# EAGLE schematic ButtonBreakout (EAGLE 9.5.0)
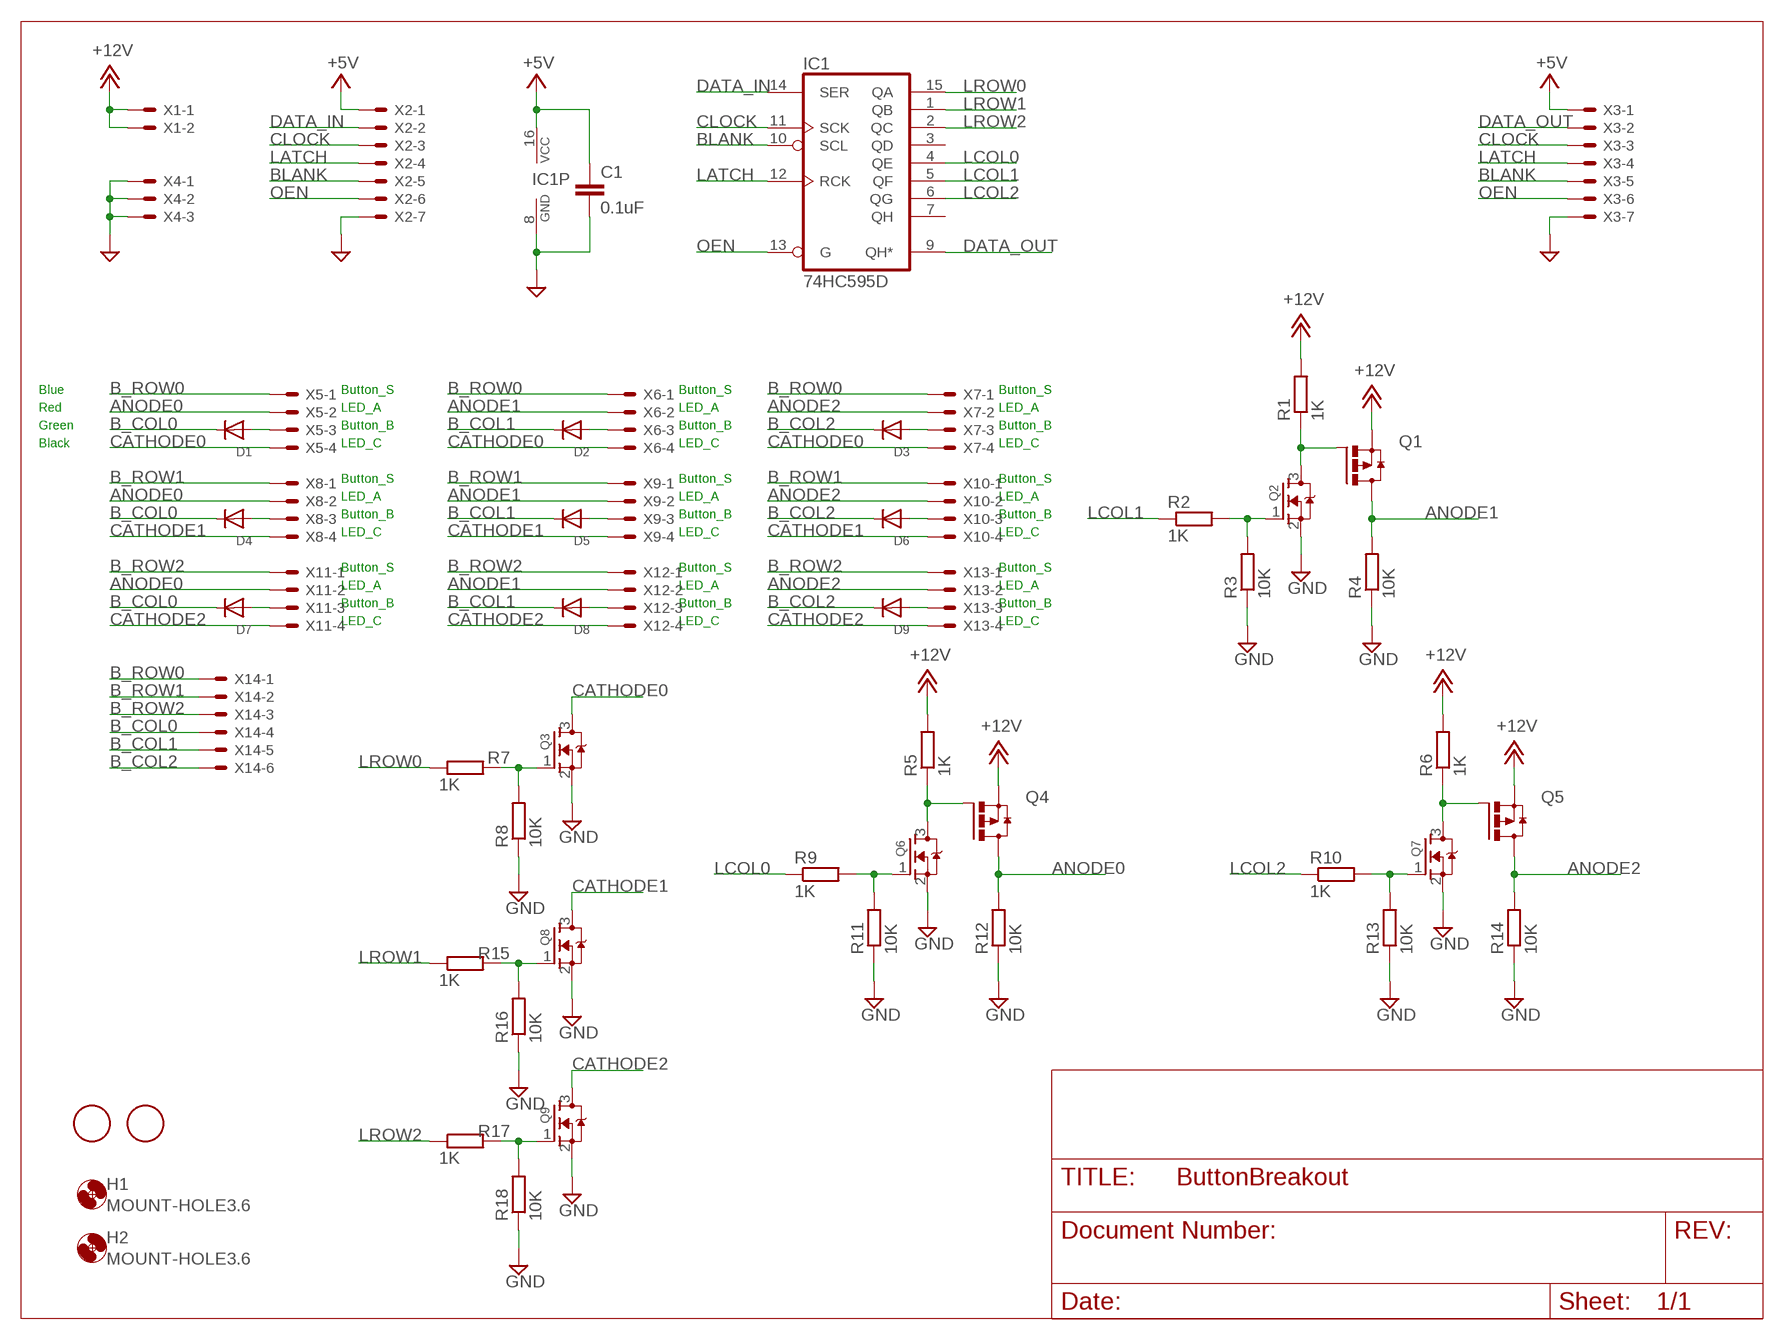
[diagram p0: schematic, sheet 1]

## Parts
C1  0.1uF  C-EUC0805  [C0805]
D1  DIODESOD-123  [SOD-123]
D2  DIODESOD-123  [SOD-123]
D3  DIODESOD-123  [SOD-123]
D4  DIODESOD-123  [SOD-123]
D5  DIODESOD-123  [SOD-123]
D6  DIODESOD-123  [SOD-123]
D7  DIODESOD-123  [SOD-123]
D8  DIODESOD-123  [SOD-123]
D9  DIODESOD-123  [SOD-123]
F1  FIDUCIAL  [FIDUCIAL_1MM]
F2  FIDUCIAL  [FIDUCIAL_1MM]
H1  MOUNT-HOLE3.6  [3,6]
H2  MOUNT-HOLE3.6  [3,6]
IC1  74HC595D  [SO16]
Q1  FDN360P  [SUPER-SOT3]
Q2  MOSFET-NREFLOW  [SOT23]
Q3  MOSFET-NREFLOW  [SOT23]
Q4  FDN360P  [SUPER-SOT3]
Q5  FDN360P  [SUPER-SOT3]
Q6  MOSFET-NREFLOW  [SOT23]
Q7  MOSFET-NREFLOW  [SOT23]
Q8  MOSFET-NREFLOW  [SOT23]
Q9  MOSFET-NREFLOW  [SOT23]
R1  1K  R-EU_R0805  [R0805]
R2  1K  R-EU_R0805  [R0805]
R3  10K  R-EU_R0805  [R0805]
R4  10K  R-EU_R0805  [R0805]
R5  1K  R-EU_R0805  [R0805]
R6  1K  R-EU_R0805  [R0805]
R7  1K  R-EU_R0805  [R0805]
R8  10K  R-EU_R0805  [R0805]
R9  1K  R-EU_R0805  [R0805]
R10  1K  R-EU_R0805  [R0805]
R11  10K  R-EU_R0805  [R0805]
R12  10K  R-EU_R0805  [R0805]
R13  10K  R-EU_R0805  [R0805]
R14  10K  R-EU_R0805  [R0805]
R15  1K  R-EU_R0805  [R0805]
R16  10K  R-EU_R0805  [R0805]
R17  1K  R-EU_R0805  [R0805]
R18  10K  R-EU_R0805  [R0805]
X1  JST-XH-02-PIN-LONG-PAD  [JST-XH-02-PACKAGE-LONG-PAD]
X2  JST-XH-07-PIN-LONG-PAD  [JST-XH-07-PACKAGE-LONG-PAD]
X3  JST-XH-07-PIN-LONG-PAD  [JST-XH-07-PACKAGE-LONG-PAD]
X4  JST-XH-03-PIN-LONG-PAD  [JST-XH-03-PACKAGE-LONG-PAD]
X5  JST-XH-04-PIN-LONG-PAD  [JST-XH-04-PACKAGE-LONG-PAD]
X6  JST-XH-04-PIN-LONG-PAD  [JST-XH-04-PACKAGE-LONG-PAD]
X7  JST-XH-04-PIN-LONG-PAD  [JST-XH-04-PACKAGE-LONG-PAD]
X8  JST-XH-04-PIN-LONG-PAD  [JST-XH-04-PACKAGE-LONG-PAD]
X9  JST-XH-04-PIN-LONG-PAD  [JST-XH-04-PACKAGE-LONG-PAD]
X10  JST-XH-04-PIN-LONG-PAD  [JST-XH-04-PACKAGE-LONG-PAD]
X11  JST-XH-04-PIN-LONG-PAD  [JST-XH-04-PACKAGE-LONG-PAD]
X12  JST-XH-04-PIN-LONG-PAD  [JST-XH-04-PACKAGE-LONG-PAD]
X13  JST-XH-04-PIN-LONG-PAD  [JST-XH-04-PACKAGE-LONG-PAD]
X14  JST-XH-06-PIN-LONG-PAD  [JST-XH-06-PACKAGE-LONG-PAD]

## Nets
+5V: C1.1 IC1.16(VCC) X2.1 X3.1
+12V: Q1.2(S) Q4.2(S) Q5.2(S) R1.2 R5.2 R6.2 X1.1 X1.2
ANODE0: Q4.3(D) R12.2 X5.2 X8.2 X11.2
ANODE1: Q1.3(D) R4.2 X6.2 X9.2 X12.2
ANODE2: Q5.3(D) R14.2 X7.2 X10.2 X13.2
B_COL0: D1.C D4.C D7.C X14.4
B_COL1: D2.C D5.C D8.C X14.5
B_COL2: D3.C D6.C D9.C X14.6
B_ROW0: X5.1 X6.1 X7.1 X14.1
B_ROW1: X8.1 X9.1 X10.1 X14.2
B_ROW2: X11.1 X12.1 X13.1 X14.3
BLANK: IC1.10(SCL) X2.5 X3.5
CATHODE0: Q3.3(D) X5.4 X6.4 X7.4
CATHODE1: Q8.3(D) X8.4 X9.4 X10.4
CATHODE2: Q9.3(D) X11.4 X12.4 X13.4
CLOCK: IC1.11(SCK) X2.3 X3.3
DATA_IN: IC1.14(SER) X2.2
DATA_OUT: IC1.9(QH*) X3.2
GND: C1.2 IC1.8(GND) Q2.2(S) Q3.2(S) Q6.2(S) Q7.2(S) Q8.2(S) Q9.2(S) R3.1 R4.1 R8.1 R11.1 R12.1 R13.1 R14.1 R16.1 R18.1 X2.7 X3.7 X4.1 X4.2 X4.3
LATCH: IC1.12(RCK) X2.4 X3.4
LCOL0: IC1.4(QE) R9.1
LCOL1: IC1.5(QF) R2.1
LCOL2: IC1.6(QG) R10.1
LROW0: IC1.15(QA) R7.1
LROW1: IC1.1(QB) R15.1
LROW2: IC1.2(QC) R17.1
N$1: Q8.1(G) R15.2 R16.2
N$2: Q9.1(G) R17.2 R18.2
N$3: Q1.1(G) Q2.3(D) R1.1
N$4: Q2.1(G) R2.2 R3.2
N$5: Q3.1(G) R7.2 R8.2
N$6: Q4.1(G) Q6.3(D) R5.1
N$7: D1.A X5.3
N$8: D2.A X6.3
N$9: D3.A X7.3
N$10: D4.A X8.3
N$11: D5.A X9.3
N$12: D6.A X10.3
N$13: D7.A X11.3
N$14: D8.A X12.3
N$15: D9.A X13.3
N$16: Q6.1(G) R9.2 R11.2
N$17: Q5.1(G) Q7.3(D) R6.1
N$18: Q7.1(G) R10.2 R13.2
OEN: IC1.13(G) X2.6 X3.6
Unconnected: IC1.3(QD) IC1.7(QH)

## Notes on the sheet
- Blue | Button_S | Button_S | Button_S
- Red | LED_A | LED_A | LED_A
- Green | Button_B | Button_B | Button_B
- Black | LED_C | LED_C | LED_C
- Button_S | Button_S | Button_S
- LED_A | LED_A | LED_A
- Button_B | Button_B | Button_B
- LED_C | LED_C | LED_C
- Button_S | Button_S | Button_S
- LED_A | LED_A | LED_A
- Button_B | Button_B | Button_B
- LED_C | LED_C | LED_C

## Library data of the parts
C1 = rcl:C-EU: CAPACITOR, European symbol; SPICEPREFIX: C
D1-D9 = adafruit:DIODE: Diode SMADIODE - SMA Surface Mount Package 20V 1A Schottky Diode Digikey: 641-1014-6-ND DO-1N4148 - Through Hole Small Current Diode SOD-123 20V 1 A (.5mV Vf) Schottky Diode - Digikey: MBRX120TPMSCT-ND SOD-323 10V 570mA (.38mV Vf, 3ns) Schottky Diode - Digikey: ZLLS410CT-ND SOD-523 30V 30mA Schottky Diode (RB751S-40TE61) - Digikey: RB751S-40TE61CT-ND SOT23-R/W - SOT23 Package (R = Solder Paste/Reflow Ovens, W = Hand-Soldering) BAT54Film 40V 300mA - Digikey: 497-7162-1-ND
F1 F2 = ECE388:FIDUCIAL: For use by pick and place machines to calibrate the vision/machine, 1mm By microbuilder.eu
H1 H2 = holes:MOUNT-HOLE: MOUNTING HOLE with drill center marker
IC1 = 74xx-eu:74*595: 8-bit SHIFT REGISTER, output latch
Q1 Q4 Q5 = transistor-power:FDN360P: Single P-Channel, PowerTrench (R) MOSFET Source: http://www.fairchildsemi.com/ds/FD/FDN360P.pdf
Q2 Q3 Q6-Q9 = adafruit:MOSFET-N: N-Channel Mosfet 2N7002E - 60V 260mA SOT23 [Digikey: 2N7002ET1GOSTR-ND] - REEL BSH103 - 30V 850mA SOT23 [Digikey: 568-5013-1-ND]
R1-R18 = rcl:R-EU_: RESISTOR, European symbol; SPICEPREFIX: R
X1 = Rembrandt Electronics - JST XH Connectors v1-0:JST-XH-02-PIN: JST XH Connector 2 Pin Wire to board connector. Pitch: 2,54 mm, (0.100") Number of pins: 2 Created by Rembrandt Electronics www.rembrandtelectronics.com
X2 X3 = Rembrandt Electronics - JST XH Connectors v1-0:JST-XH-07-PIN: JST XH Connector 2 Pin Wire to board connector. Pitch: 2,54 mm, (0.100") Number of pins: 7 Created by Rembrandt Electronics www.rembrandtelectronics.com
X4 = Rembrandt Electronics - JST XH Connectors v1-0:JST-XH-03-PIN: JST XH Connector 2 Pin Wire to board connector. Pitch: 2,54 mm, (0.100") Number of pins: 3 Created by Rembrandt Electronics www.rembrandtelectronics.com
X5-X13 = Rembrandt Electronics - JST XH Connectors v1-0:JST-XH-04-PIN: JST XH Connector 2 Pin Wire to board connector. Pitch: 2,54 mm, (0.100") Number of pins: 4 Created by Rembrandt Electronics www.rembrandtelectronics.com
X14 = Rembrandt Electronics - JST XH Connectors v1-0:JST-XH-06-PIN: JST XH Connector 2 Pin Wire to board connector. Pitch: 2,54 mm, (0.100") Number of pins: 6 Created by Rembrandt Electronics www.rembrandtelectronics.com